# EAGLE schematic gravicapa (EAGLE 6.1)
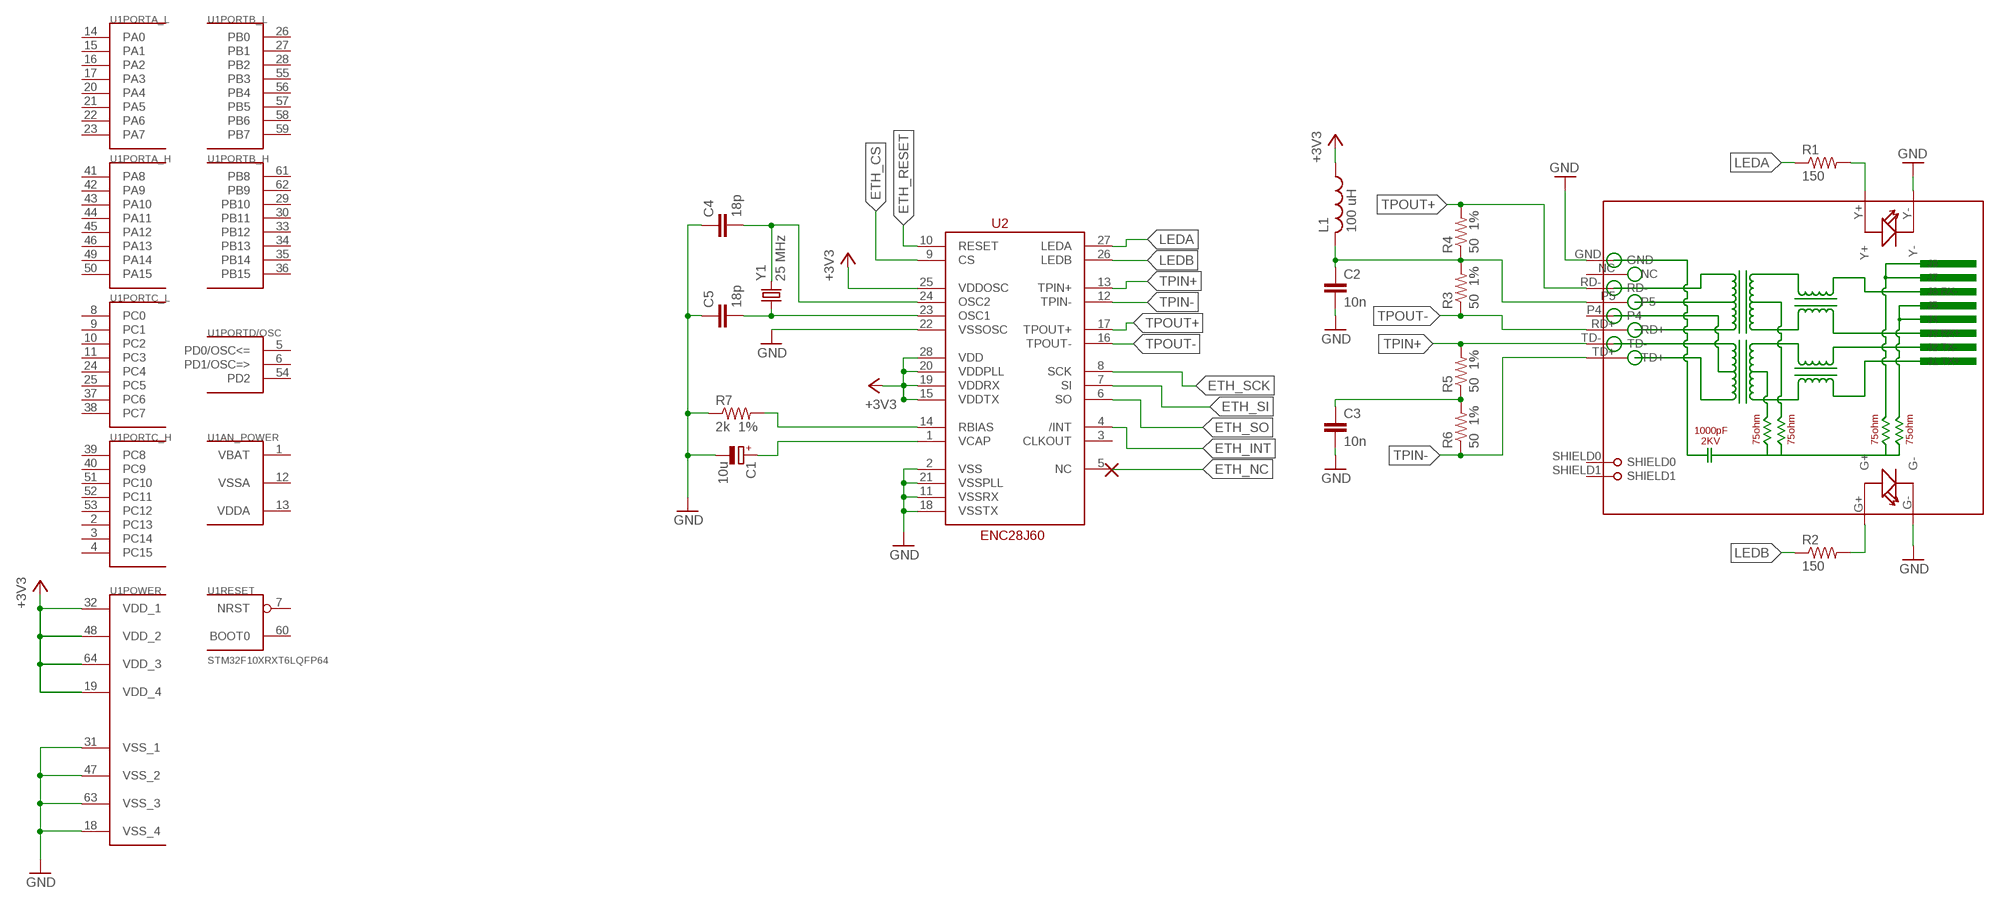
[diagram p0: schematic, sheet 1]

## Parts
C1  10u  CPOL-EUSMCB  [SMC_B]
C2  10n  CAP0805  [0805]
C3  10n  CAP0805  [0805]
C4  18p  CAP0805  [0805]
C5  18p  CAP0805  [0805]
L1  100 uH  L-USWE-TPC  [POWER-CHOKE_WE-TPC]
R1  150  RESISTOR0805-RES  [0805]
R2  150  RESISTOR0805-RES  [0805]
R3  50 1%  RESISTOR0805-RES  [0805]
R4  50 1%  RESISTOR0805-RES  [0805]
R5  50 1%  RESISTOR0805-RES  [0805]
R6  50 1%  RESISTOR0805-RES  [0805]
R7  2k 1%  RESISTOR0805-RES  [0805]
RJ1  HR911105A  [HR911105A]
U1  STM32F10XRXT6LQFP64  [LQFP64_MILL]
U2  ENC28J60  [SSOP28DB]
Y1  25 MHz  CRYSTALHC49UV  [HC49U-V]

## Nets
+3V3: L1.1 U1.19(POWER:VDD_4) U1.32(POWER:VDD_1) U1.48(POWER:VDD_2) U1.64(POWER:VDD_3) U2.15(VDDTX) U2.19(VDDRX) U2.20(VDDPLL) U2.25(VDDOSC) U2.28(VDD)
ETH_CS: U2.9(CS)
ETH_INT: U2.4(/INT)
ETH_NC: U2.5(NC)
ETH_RESET: U2.10(RESET)
ETH_SCK: U2.8(SCK)
ETH_SI: U2.7(SI)
ETH_SO: U2.6(SO)
GND: C1.- C2.2 C3.2 C4.1 C5.1 R7.1 RJ1.G- RJ1.GND RJ1.Y- U1.18(POWER:VSS_4) U1.31(POWER:VSS_1) U1.47(POWER:VSS_2) U1.63(POWER:VSS_3) U2.2(VSS) U2.11(VSSRX) U2.18(VSSTX) U2.21(VSSPLL) U2.22(VSSOSC)
LEDA: R1.1 U2.27(LEDA)
LEDB: R2.1 U2.26(LEDB)
N$1: C2.1 L1.2 R3.2 R4.1 RJ1.P5
N$2: R2.2 RJ1.G+
N$3: R1.2 RJ1.Y+
N$4: R7.2 U2.14(RBIAS)
N$5: C5.2 U2.23(OSC1) Y1.1
N$6: C4.2 U2.24(OSC2) Y1.2
N$7: C1.+ U2.1(VCAP)
N$9: C3.1 R5.1 R6.2
TPIN+: R5.2 RJ1.TD- U2.13(TPIN+)
TPIN-: R6.1 RJ1.TD+ U2.12(TPIN-)
TPOUT+: R4.2 RJ1.RD- U2.17(TPOUT+)
TPOUT-: R3.1 RJ1.RD+ U2.16(TPOUT-)
Unconnected: RJ1.NC RJ1.P4 RJ1.SHIELD0 RJ1.SHIELD1 U1.2(PORTC_H:PC13) U1.3(PORTC_H:PC14) U1.4(PORTC_H:PC15) U1.5(PORTD/OSC:PD0/OSC<=) U1.6(PORTD/OSC:PD1/OSC=>) U1.7(RESET:NRST) U1.8(PORTC_L:PC0) U1.9(PORTC_L:PC1) U1.10(PORTC_L:PC2) U1.11(PORTC_L:PC3) U1.14(PORTA_L:PA0) U1.15(PORTA_L:PA1) U1.16(PORTA_L:PA2) U1.17(PORTA_L:PA3) U1.20(PORTA_L:PA4) U1.21(PORTA_L:PA5) U1.22(PORTA_L:PA6) U1.23(PORTA_L:PA7) U1.24(PORTC_L:PC4) U1.25(PORTC_L:PC5) U1.26(PORTB_L:PB0) U1.27(PORTB_L:PB1) U1.28(PORTB_L:PB2) U1.29(PORTB_H:PB10) U1.30(PORTB_H:PB11) U1.33(PORTB_H:PB12) U1.34(PORTB_H:PB13) U1.35(PORTB_H:PB14) U1.36(PORTB_H:PB15) U1.37(PORTC_L:PC6) U1.38(PORTC_L:PC7) U1.39(PORTC_H:PC8) U1.40(PORTC_H:PC9) U1.41(PORTA_H:PA8) U1.42(PORTA_H:PA9) U1.43(PORTA_H:PA10) U1.44(PORTA_H:PA11) U1.45(PORTA_H:PA12) U1.46(PORTA_H:PA13) U1.49(PORTA_H:PA14) U1.50(PORTA_H:PA15) U1.51(PORTC_H:PC10) U1.52(PORTC_H:PC11) U1.53(PORTC_H:PC12) U1.54(PORTD/OSC:PD2) U1.55(PORTB_L:PB3) U1.56(PORTB_L:PB4) U1.57(PORTB_L:PB5) U1.58(PORTB_L:PB6) U1.59(PORTB_L:PB7) U1.60(RESET:BOOT0) U1.61(PORTB_H:PB8) U1.62(PORTB_H:PB9) U2.3(CLKOUT)

## Power pins joined to a net without a drawn wire
VBAT: U1.1(AN_POWER:VBAT)
VDDA: U1.13(AN_POWER:VDDA)
VSSA: U1.12(AN_POWER:VSSA)

## Library data of the parts
C1 = GravicapaLib:CPOL-EU: POLARIZED CAPACITOR, European symbol
C2-C5 = GravicapaLib:CAP: Capacitor Standard 0603 ceramic capacitor, and 0.1" leaded capacitor.
L1 = GravicapaLib:L-US: INDUCTOR, American symbol
R1-R7 = GravicapaLib:RESISTOR: Resistor Basic schematic elements and footprints for 0603, 1206, and PTH resistors.
RJ1 = GravicapaLib:HR911105A
U1 = GravicapaLib:STM32F10XRXT6: STM32F101/103 64pin LQFP
U2 = GravicapaLib:ENC28J60
Y1 = GravicapaLib:CRYSTAL: Crystals Various standard crystals. Proven footprints. Spark Fun Electronics SKU : COM-00534